# Altium project OneWireController.PrjPcb
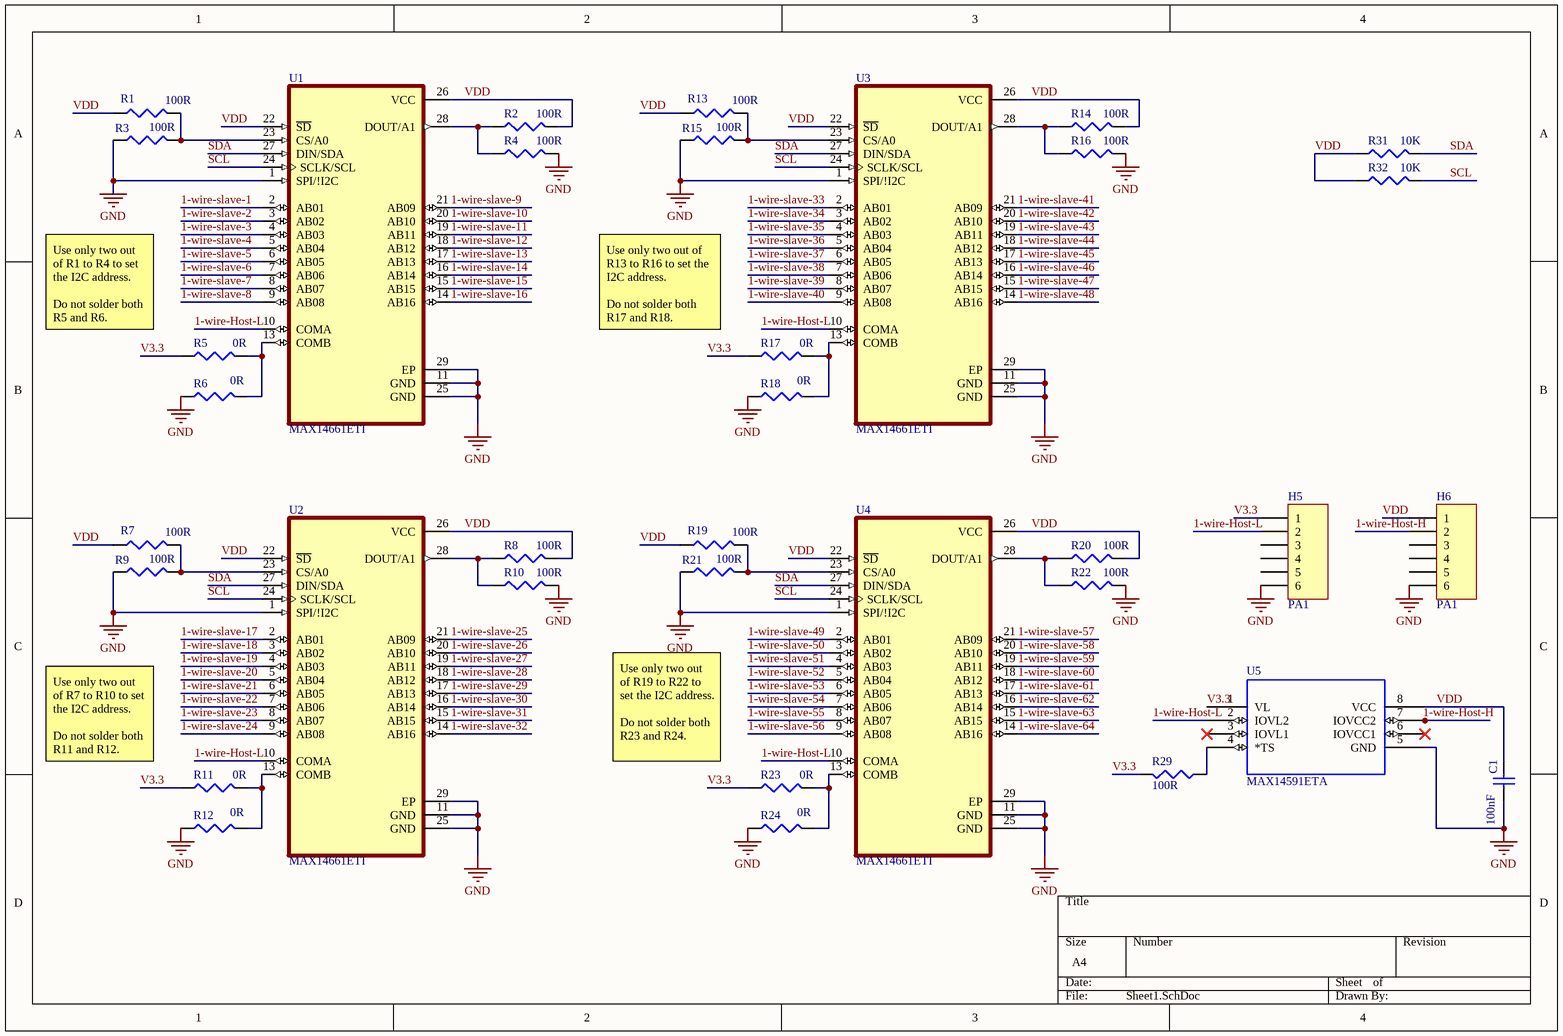
[diagram p0: Sheet1.SchDoc]
3 sheets, 126 parts. Net scope: global (net labels, ports and power ports of the same name join across sheets).
Board file: OneWireController.PcbDoc
Sheets:
  Sheet1.SchDoc
  Sheet2.SchDoc
  Sheet3.SchDoc

## Sheet Sheet1.SchDoc
size A4

### Parts
C1  value 100nF  [CAPC1608L]
H5  PA1  [HDR1X6]
H6  PA1  [HDR1X6]
R1  value 100R  [J1-0603]
R2  value 100R  [J1-0603]
R3  value 100R  [J1-0603]
R4  value 100R  [J1-0603]
R5  value 0R  [J1-0603]
R6  value 0R  [J1-0603]
R7  value 100R  [J1-0603]
R8  value 100R  [J1-0603]
R9  value 100R  [J1-0603]
R10  value 100R  [J1-0603]
R11  value 0R  [J1-0603]
R12  value 0R  [J1-0603]
R13  value 100R  [J1-0603]
R14  value 100R  [J1-0603]
R15  value 100R  [J1-0603]
R16  value 100R  [J1-0603]
R17  value 0R  [J1-0603]
R18  value 0R  [J1-0603]
R19  value 100R  [J1-0603]
R20  value 100R  [J1-0603]
R21  value 100R  [J1-0603]
R22  value 100R  [J1-0603]
R23  value 0R  [J1-0603]
R24  value 0R  [J1-0603]
R29  value 100R  [J1-0603]
R31  value 10K  [J1-0603]
R32  value 10K  [J1-0603]
U1  MAX14661ETI  [QFN40P400X400X80-29N]
U2  MAX14661ETI  [QFN40P400X400X80-29N]
U3  MAX14661ETI  [QFN40P400X400X80-29N]
U4  MAX14661ETI  [QFN40P400X400X80-29N]
U5  MAX14591ETA  [21-0487A]

### Nets
GND: C1.2 H5.6 H6.6 R3.1 R4.1 R6.1 R9.1 R10.1 R12.1 R15.1 R16.1 R18.1 R21.1 R22.1 R24.1 U1.1(SPI/!I2C) U1.11(GND) U1.25(GND) U1.29(EP) U2.1(SPI/!I2C) U2.11(GND) U2.25(GND) U2.29(EP) U3.1(SPI/!I2C) U3.11(GND) U3.25(GND) U3.29(EP) U4.1(SPI/!I2C) U4.11(GND) U4.25(GND) U4.29(EP) U5.5(GND)
1-wire-Host-H: H6.2 U5.7(IOVCC2)
1-wire-Host-L: H5.2 U1.10(COMA) U2.10(COMA) U3.10(COMA) U4.10(COMA) U5.2(IOVL2)
1-wire-slave-1: U1.2(AB01)
1-wire-slave-2: U1.3(AB02)
1-wire-slave-3: U1.4(AB03)
1-wire-slave-4: U1.5(AB04)
1-wire-slave-5: U1.6(AB05)
1-wire-slave-6: U1.7(AB06)
1-wire-slave-7: U1.8(AB07)
1-wire-slave-8: U1.9(AB08)
1-wire-slave-9: U1.21(AB09)
1-wire-slave-10: U1.20(AB10)
1-wire-slave-11: U1.19(AB11)
1-wire-slave-12: U1.18(AB12)
1-wire-slave-13: U1.17(AB13)
1-wire-slave-14: U1.16(AB14)
1-wire-slave-15: U1.15(AB15)
1-wire-slave-16: U1.14(AB16)
1-wire-slave-17: U2.2(AB01)
1-wire-slave-18: U2.3(AB02)
1-wire-slave-19: U2.4(AB03)
1-wire-slave-20: U2.5(AB04)
1-wire-slave-21: U2.6(AB05)
1-wire-slave-22: U2.7(AB06)
1-wire-slave-23: U2.8(AB07)
1-wire-slave-24: U2.9(AB08)
1-wire-slave-25: U2.21(AB09)
1-wire-slave-26: U2.20(AB10)
1-wire-slave-27: U2.19(AB11)
1-wire-slave-28: U2.18(AB12)
1-wire-slave-29: U2.17(AB13)
1-wire-slave-30: U2.16(AB14)
1-wire-slave-31: U2.15(AB15)
1-wire-slave-32: U2.14(AB16)
1-wire-slave-33: U3.2(AB01)
1-wire-slave-34: U3.3(AB02)
1-wire-slave-35: U3.4(AB03)
1-wire-slave-36: U3.5(AB04)
1-wire-slave-37: U3.6(AB05)
1-wire-slave-38: U3.7(AB06)
1-wire-slave-39: U3.8(AB07)
1-wire-slave-40: U3.9(AB08)
1-wire-slave-41: U3.21(AB09)
1-wire-slave-42: U3.20(AB10)
1-wire-slave-43: U3.19(AB11)
1-wire-slave-44: U3.18(AB12)
1-wire-slave-45: U3.17(AB13)
1-wire-slave-46: U3.16(AB14)
1-wire-slave-47: U3.15(AB15)
1-wire-slave-48: U3.14(AB16)
1-wire-slave-49: U4.2(AB01)
1-wire-slave-50: U4.3(AB02)
1-wire-slave-51: U4.4(AB03)
1-wire-slave-52: U4.5(AB04)
1-wire-slave-53: U4.6(AB05)
1-wire-slave-54: U4.7(AB06)
1-wire-slave-55: U4.8(AB07)
1-wire-slave-56: U4.9(AB08)
1-wire-slave-57: U4.21(AB09)
1-wire-slave-58: U4.20(AB10)
1-wire-slave-59: U4.19(AB11)
1-wire-slave-60: U4.18(AB12)
1-wire-slave-61: U4.17(AB13)
1-wire-slave-62: U4.16(AB14)
1-wire-slave-63: U4.15(AB15)
1-wire-slave-64: U4.14(AB16)
SCL: R32.1 U1.24(SCLK/SCL) U2.24(SCLK/SCL) U3.24(SCLK/SCL) U4.24(SCLK/SCL)
SDA: R31.1 U1.27(DIN/SDA) U2.27(DIN/SDA) U3.27(DIN/SDA) U4.27(DIN/SDA)
V3.3: H5.1 R5.1 R11.1 R17.1 R23.1 R29.1 U5.1(VL)
VDD: C1.1 H6.1 R1.1 R2.1 R7.1 R8.1 R13.1 R14.1 R19.1 R20.1 R31.2 R32.2 U1.22(~{SD}) U1.26(VCC) U2.22(~{SD}) U2.26(VCC) U3.22(~{SD}) U3.26(VCC) U4.22(~{SD}) U4.26(VCC) U5.8(VCC)
NetR1_2: R1.2 R3.2 U1.23(CS/A0)
NetR2_2: R2.2 R4.2 U1.28(DOUT/A1)
NetR5_2: R5.2 R6.2 U1.13(COMB)
NetR7_2: R7.2 R9.2 U2.23(CS/A0)
NetR8_2: R8.2 R10.2 U2.28(DOUT/A1)
NetR11_2: R11.2 R12.2 U2.13(COMB)
NetR13_2: R13.2 R15.2 U3.23(CS/A0)
NetR14_2: R14.2 R16.2 U3.28(DOUT/A1)
NetR17_2: R17.2 R18.2 U3.13(COMB)
NetR19_2: R19.2 R21.2 U4.23(CS/A0)
NetR20_2: R20.2 R22.2 U4.28(DOUT/A1)
NetR23_2: R23.2 R24.2 U4.13(COMB)
NetR29_2: R29.2 U5.4(*TS)

Not connected (* = marked no-connect by the designer): H5 3 4 5; H6 3 4 5; U5 3(IOVL1)* 6(IOVCC1)*

### Notes on the sheet
- (near R5) Use only two out of R1 to R4 to set the I2C address.
  Do not solder both R5 and R6.
- (near R17) Use only two out of R13 to R16 to set the I2C address.
  Do not solder both R17 and R18.
- (near R11) Use only two out of R7 to R10 to set the I2C address.
  Do not solder both R11 and R12.
- (near R23) Use only two out of R19 to R22 to set the I2C address.
  Do not solder both R23 and R24.

### Library data of the parts
C1 = Cap Semi: Capacitor (Semiconductor SIM Model); Published: 8-Jun-2000; LatestRevisionDate: 29-May-2009; LatestRevisionNote: IPC-7351 Footprint Added.; PackageReference: C1206; Publisher: Altium Limited; PackageDescription: Chip Capacitor
H5 H6 = Header 6: Header, 6-Pin; LatestRevisionDate: 17-Jul-2002; LatestRevisionNote: Re-released for DXP Platform.; Publisher: Altium Limited
R1-R24 R29 R31 R32 = Res3: Resistor; Published: 8-Jun-2000; LatestRevisionDate: 29-May-2009; LatestRevisionNote: IPC-7351 Footprint Added.; PackageReference: J1-0603; Publisher: Altium Limited; PackageDescription: Chip Resistor
U1-U4 = MAX14661ETI: None; MF: {'manufacturer': u'Maxim Integrated'}; Price: None; Availability: Unavailable; Value: *; MP: MAX14661ETI; Package: None
U5 = MAX14591ETA: MF: {'manufacturer': u'Maxim Integrated'}; MP: MAX14591ETA; Value: *; Package: None; Price: None; Availability: Unavailable

## Sheet Sheet2.SchDoc
size A4
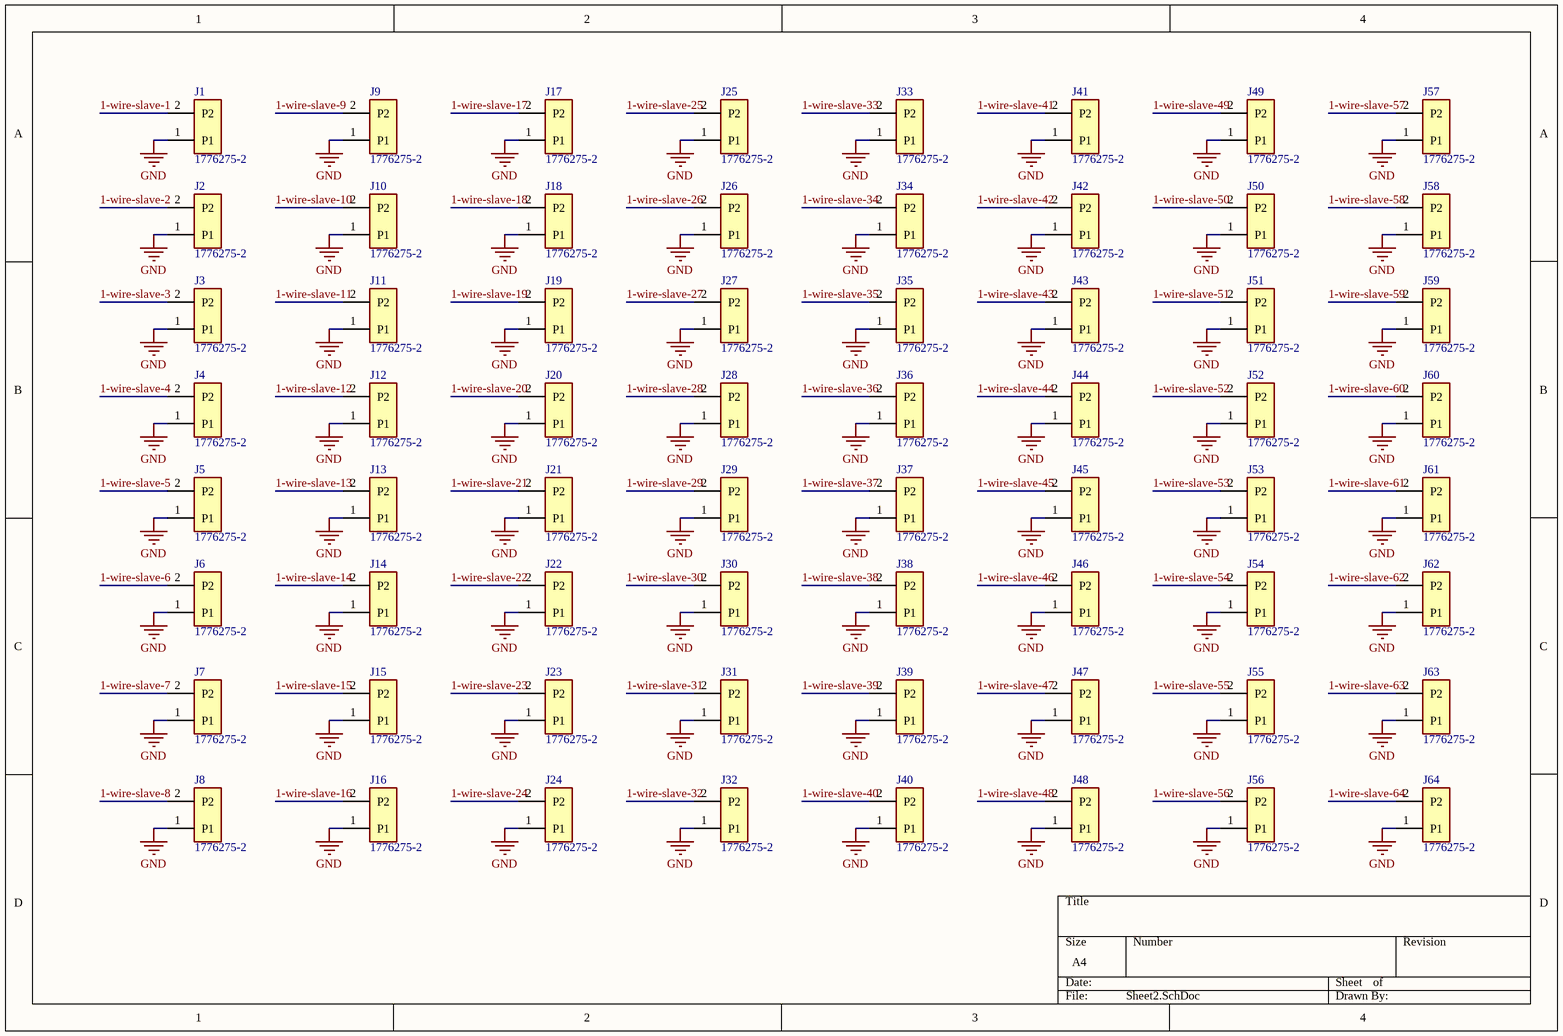
[diagram p1: Sheet2.SchDoc]

### Parts
J1  1776275-2  [TE_1776275-2]
J2  1776275-2  [TE_1776275-2]
J3  1776275-2  [TE_1776275-2]
J4  1776275-2  [TE_1776275-2]
J5  1776275-2  [TE_1776275-2]
J6  1776275-2  [TE_1776275-2]
J7  1776275-2  [TE_1776275-2]
J8  1776275-2  [TE_1776275-2]
J9  1776275-2  [TE_1776275-2]
J10  1776275-2  [TE_1776275-2]
J11  1776275-2  [TE_1776275-2]
J12  1776275-2  [TE_1776275-2]
J13  1776275-2  [TE_1776275-2]
J14  1776275-2  [TE_1776275-2]
J15  1776275-2  [TE_1776275-2]
J16  1776275-2  [TE_1776275-2]
J17  1776275-2  [TE_1776275-2]
J18  1776275-2  [TE_1776275-2]
J19  1776275-2  [TE_1776275-2]
J20  1776275-2  [TE_1776275-2]
J21  1776275-2  [TE_1776275-2]
J22  1776275-2  [TE_1776275-2]
J23  1776275-2  [TE_1776275-2]
J24  1776275-2  [TE_1776275-2]
J25  1776275-2  [TE_1776275-2]
J26  1776275-2  [TE_1776275-2]
J27  1776275-2  [TE_1776275-2]
J28  1776275-2  [TE_1776275-2]
J29  1776275-2  [TE_1776275-2]
J30  1776275-2  [TE_1776275-2]
J31  1776275-2  [TE_1776275-2]
J32  1776275-2  [TE_1776275-2]
J33  1776275-2  [TE_1776275-2]
J34  1776275-2  [TE_1776275-2]
J35  1776275-2  [TE_1776275-2]
J36  1776275-2  [TE_1776275-2]
J37  1776275-2  [TE_1776275-2]
J38  1776275-2  [TE_1776275-2]
J39  1776275-2  [TE_1776275-2]
J40  1776275-2  [TE_1776275-2]
J41  1776275-2  [TE_1776275-2]
J42  1776275-2  [TE_1776275-2]
J43  1776275-2  [TE_1776275-2]
J44  1776275-2  [TE_1776275-2]
J45  1776275-2  [TE_1776275-2]
J46  1776275-2  [TE_1776275-2]
J47  1776275-2  [TE_1776275-2]
J48  1776275-2  [TE_1776275-2]
J49  1776275-2  [TE_1776275-2]
J50  1776275-2  [TE_1776275-2]
J51  1776275-2  [TE_1776275-2]
J52  1776275-2  [TE_1776275-2]
J53  1776275-2  [TE_1776275-2]
J54  1776275-2  [TE_1776275-2]
J55  1776275-2  [TE_1776275-2]
J56  1776275-2  [TE_1776275-2]
J57  1776275-2  [TE_1776275-2]
J58  1776275-2  [TE_1776275-2]
J59  1776275-2  [TE_1776275-2]
J60  1776275-2  [TE_1776275-2]
J61  1776275-2  [TE_1776275-2]
J62  1776275-2  [TE_1776275-2]
J63  1776275-2  [TE_1776275-2]
J64  1776275-2  [TE_1776275-2]

### Nets
GND: J1.1(P1) J2.1(P1) J3.1(P1) J4.1(P1) J5.1(P1) J6.1(P1) J7.1(P1) J8.1(P1) J9.1(P1) J10.1(P1) J11.1(P1) J12.1(P1) J13.1(P1) J14.1(P1) J15.1(P1) J16.1(P1) J17.1(P1) J18.1(P1) J19.1(P1) J20.1(P1) J21.1(P1) J22.1(P1) J23.1(P1) J24.1(P1) J25.1(P1) J26.1(P1) J27.1(P1) J28.1(P1) J29.1(P1) J30.1(P1) J31.1(P1) J32.1(P1) J33.1(P1) J34.1(P1) J35.1(P1) J36.1(P1) J37.1(P1) J38.1(P1) J39.1(P1) J40.1(P1) J41.1(P1) J42.1(P1) J43.1(P1) J44.1(P1) J45.1(P1) J46.1(P1) J47.1(P1) J48.1(P1) J49.1(P1) J50.1(P1) J51.1(P1) J52.1(P1) J53.1(P1) J54.1(P1) J55.1(P1) J56.1(P1) J57.1(P1) J58.1(P1) J59.1(P1) J60.1(P1) J61.1(P1) J62.1(P1) J63.1(P1) J64.1(P1)
1-wire-slave-1: J1.2(P2)
1-wire-slave-2: J2.2(P2)
1-wire-slave-3: J3.2(P2)
1-wire-slave-4: J4.2(P2)
1-wire-slave-5: J5.2(P2)
1-wire-slave-6: J6.2(P2)
1-wire-slave-7: J7.2(P2)
1-wire-slave-8: J8.2(P2)
1-wire-slave-9: J9.2(P2)
1-wire-slave-10: J10.2(P2)
1-wire-slave-11: J11.2(P2)
1-wire-slave-12: J12.2(P2)
1-wire-slave-13: J13.2(P2)
1-wire-slave-14: J14.2(P2)
1-wire-slave-15: J15.2(P2)
1-wire-slave-16: J16.2(P2)
1-wire-slave-17: J17.2(P2)
1-wire-slave-18: J18.2(P2)
1-wire-slave-19: J19.2(P2)
1-wire-slave-20: J20.2(P2)
1-wire-slave-21: J21.2(P2)
1-wire-slave-22: J22.2(P2)
1-wire-slave-23: J23.2(P2)
1-wire-slave-24: J24.2(P2)
1-wire-slave-25: J25.2(P2)
1-wire-slave-26: J26.2(P2)
1-wire-slave-27: J27.2(P2)
1-wire-slave-28: J28.2(P2)
1-wire-slave-29: J29.2(P2)
1-wire-slave-30: J30.2(P2)
1-wire-slave-31: J31.2(P2)
1-wire-slave-32: J32.2(P2)
1-wire-slave-33: J33.2(P2)
1-wire-slave-34: J34.2(P2)
1-wire-slave-35: J35.2(P2)
1-wire-slave-36: J36.2(P2)
1-wire-slave-37: J37.2(P2)
1-wire-slave-38: J38.2(P2)
1-wire-slave-39: J39.2(P2)
1-wire-slave-40: J40.2(P2)
1-wire-slave-41: J41.2(P2)
1-wire-slave-42: J42.2(P2)
1-wire-slave-43: J43.2(P2)
1-wire-slave-44: J44.2(P2)
1-wire-slave-45: J45.2(P2)
1-wire-slave-46: J46.2(P2)
1-wire-slave-47: J47.2(P2)
1-wire-slave-48: J48.2(P2)
1-wire-slave-49: J49.2(P2)
1-wire-slave-50: J50.2(P2)
1-wire-slave-51: J51.2(P2)
1-wire-slave-52: J52.2(P2)
1-wire-slave-53: J53.2(P2)
1-wire-slave-54: J54.2(P2)
1-wire-slave-55: J55.2(P2)
1-wire-slave-56: J56.2(P2)
1-wire-slave-57: J57.2(P2)
1-wire-slave-58: J58.2(P2)
1-wire-slave-59: J59.2(P2)
1-wire-slave-60: J60.2(P2)
1-wire-slave-61: J61.2(P2)
1-wire-slave-62: J62.2(P2)
1-wire-slave-63: J63.2(P2)
1-wire-slave-64: J64.2(P2)

### Library data of the parts
J1-J64 = 1776275-2: TERM BLOCK 2POS SIDE ENT 3.5MM; MF: {'manufacturer': u'TE Connectivity'}; Value: *; MP: 1776275-2; Availability: Unavailable; Price: None; Package: None

## Sheet Sheet3.SchDoc
size A4
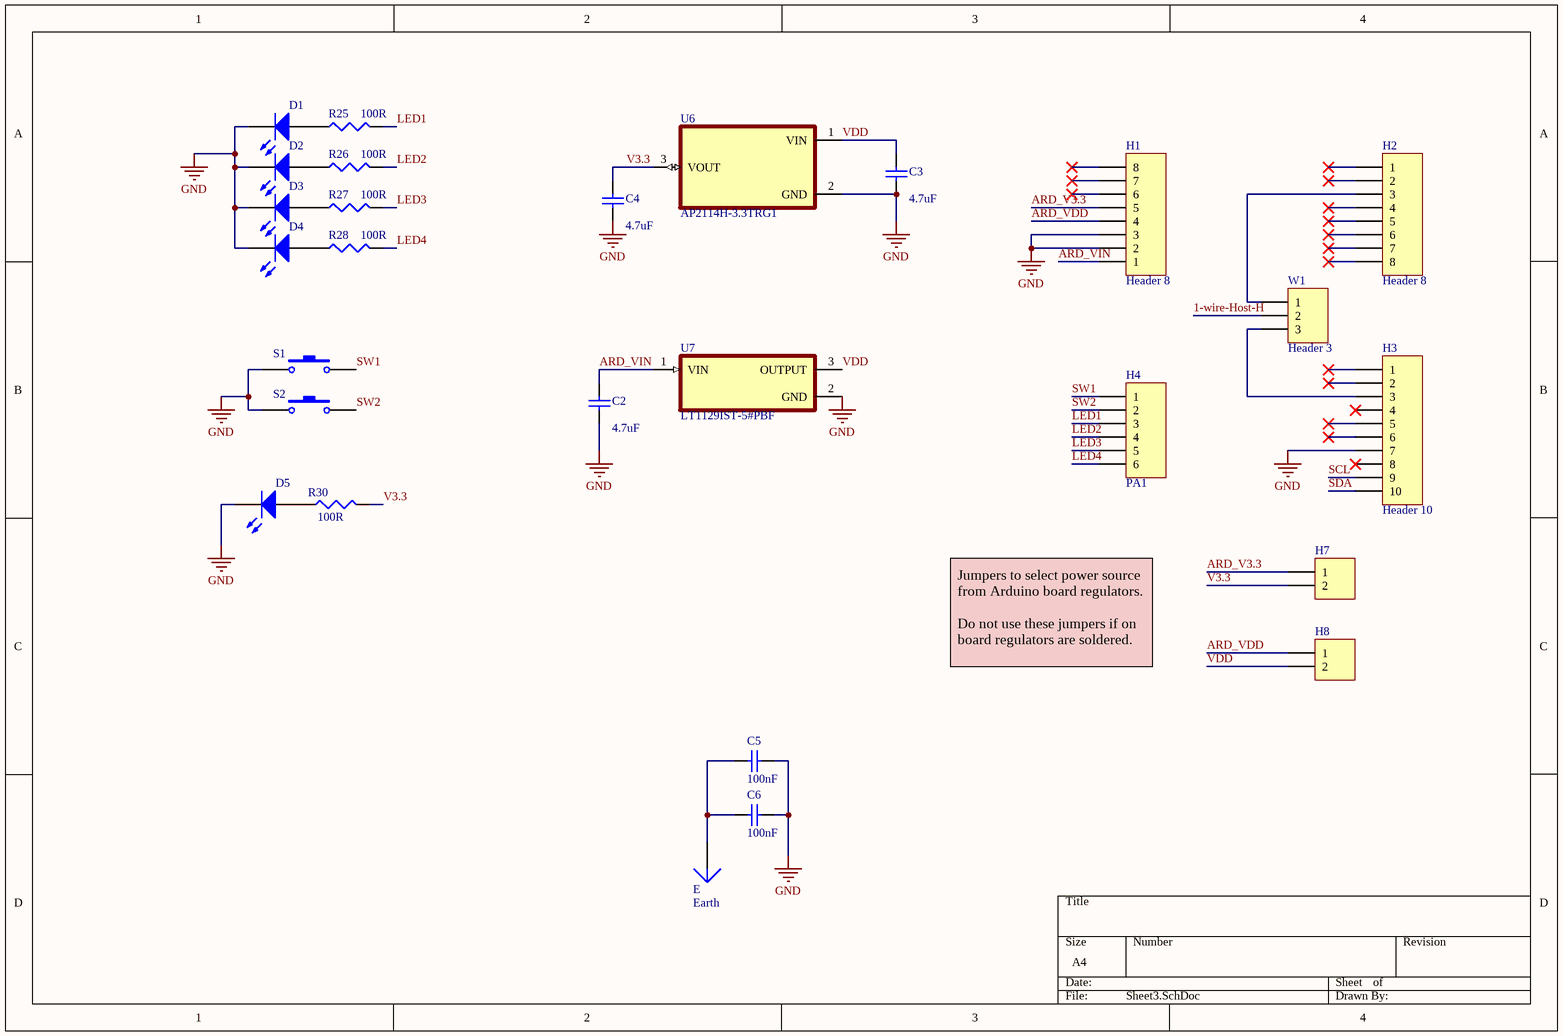
[diagram p2: Sheet3.SchDoc]

### Parts
C2  value 4.7uF  [C0805]
C3  value 4.7uF  [C0805]
C4  value 4.7uF  [C0805]
C5  value 100nF  [CAPC1608L]
C6  value 100nF  [CAPC1608L]
D1  (no value)  [6-0805_N]
D2  (no value)  [6-0805_N]
D3  (no value)  [6-0805_N]
D4  (no value)  [6-0805_N]
D5  (no value)  [6-0805_N]
E  Earth  [PIN1]
H1  Header 8  [HDR1X8]
H2  Header 8  [HDR1X8]
H3  Header 10  [HDR1X10]
H4  PA1  [HDR1X6]
H7  (no value)  [HDR1X2]
H8  (no value)  [HDR1X2]
R25  value 100R  [J1-0603]
R26  value 100R  [J1-0603]
R27  value 100R  [J1-0603]
R28  value 100R  [J1-0603]
R30  value 100R  [J1-0603]
S1  (no value)  [PTS525SM08SMTR2LFS]
S2  (no value)  [PTS525SM08SMTR2LFS]
U6  AP2114H-3.3TRG1  [SOT230P700X180-4N]
U7  LT1129IST-5#PBF  [SOT230P700X180-4N]
W1  Header 3  [HDR1X3]

### Nets
GND: C2.1 C3.1 C4.1 C5.2 C6.2 D1.2(K) D2.2(K) D3.2(K) D4.2(K) D5.2(K) H1.2 H1.3 H3.7 S1.1 S2.1 U6.2(GND) U7.2(GND)
1-wire-Host-H: W1.2
ARD_V3.3: H1.5 H7.1
ARD_VDD: H1.4 H8.1
ARD_VIN: C2.2 H1.1 U7.1(VIN)
LED1: H4.3 R25.1
LED2: H4.4 R26.1
LED3: H4.5 R27.1
LED4: H4.6 R28.1
SCL: H3.9
SDA: H3.10
SW1: H4.1 S1.2
SW2: H4.2 S2.2
V3.3: C4.2 H7.2 R30.1 U6.3(VOUT)
VDD: C3.2 H8.2 U6.1(VIN) U7.3(OUTPUT)
NetC5_1: C5.1 C6.1 E.1
NetD1_1: D1.1(A) R25.2
NetD2_1: D2.1(A) R26.2
NetD3_1: D3.1(A) R27.2
NetD4_1: D4.1(A) R28.2
NetD5_1: D5.1(A) R30.2
NetH2_3: H2.3 W1.1
NetH3_3: H3.3 W1.3

Not connected (* = marked no-connect by the designer): H1 6* 7* 8*; H2 1* 2* 4* 5* 6* 7* 8*; H3 1* 2* 4* 5* 6* 8*

### Notes on the sheet
- Jumpers to select power source from Arduino board regulators.
  Do not use these jumpers if on board regulators are soldered.

### Library data of the parts
C2-C6 = Cap Semi: Capacitor (Semiconductor SIM Model); Published: 8-Jun-2000; LatestRevisionDate: 29-May-2009; LatestRevisionNote: IPC-7351 Footprint Added.; PackageReference: C1206; Publisher: Altium Limited; PackageDescription: Chip Capacitor
D1-D5 = LED3: Typical BLUE SiC LED; Published: 8-Jun-2000; LatestRevisionDate: 17-Dec-2003; LatestRevisionNote: PCB Footprint replaced.; DatasheetVersion: 16-Apr-2002; PackageVersion: 16-Apr-2002; PackageReference: 3.5X2.8X1.9; Publisher: Altium Limited; PackageDescription: SM LED; 2 C-Bend Leads; Body 3.5 x 2.8 x 1.9 mm, inc leads (LxWxH typ)
E = Plug: LatestRevisionDate: 17-Jul-2002; LatestRevisionNote: Re-released for DXP Platform.; Publisher: Altium Limited
H1 H2 = Header 8: Header, 8-Pin; LatestRevisionDate: 17-Jul-2002; LatestRevisionNote: Re-released for DXP Platform.; Publisher: Altium Limited
H3 = Header 10: Header, 10-Pin; LatestRevisionDate: 17-Jul-2002; LatestRevisionNote: Re-released for DXP Platform.; Publisher: Altium Limited
H4 = Header 6: Header, 6-Pin; LatestRevisionDate: 17-Jul-2002; LatestRevisionNote: Re-released for DXP Platform.; Publisher: Altium Limited
H7 H8 = Header 2: Header, 2-Pin; LatestRevisionDate: 17-Jul-2002; LatestRevisionNote: Re-released for DXP Platform.; Publisher: Altium Limited
R25-R28 R30 = Res3: Resistor; Published: 8-Jun-2000; LatestRevisionDate: 29-May-2009; LatestRevisionNote: IPC-7351 Footprint Added.; PackageReference: J1-0603; Publisher: Altium Limited; PackageDescription: Chip Resistor
S1 S2 = SW-PB: Switch; Published: 24-Mar-1999; LatestRevisionDate: 17-Jul-2002; LatestRevisionNote: Re-released for DXP Platform.; PackageReference: SPST-2; Publisher: Altium Limited; PackageDescription: Switch; 2 Leads
U6 = AP2114H-3.3TRG1: MF: {'manufacturer': u'Diodes Inc.'}; Price: None; Availability: Unavailable; Value: *; MP: AP2114H-3.3TRG1; Package: None
U7 = LT1129IST-5#PBF: MF: {'manufacturer': u'Analog Devices'}; Availability: Unavailable; Price: None; Value: *; MP: LT1129IST-5#PBF; Package: None
W1 = Header 3: Header, 3-Pin; LatestRevisionDate: 17-Jul-2002; LatestRevisionNote: Re-released for DXP Platform.; Publisher: Altium Limited

## Nets that join several sheets
GND: Sheet1 (32 pins), Sheet2 (64 pins), Sheet3 (17 pins)
1-wire-Host-H: Sheet1 (H6.2 U5.7), Sheet3 (W1.2)
1-wire-slave-1: Sheet1 (U1.2), Sheet2 (J1.2)
1-wire-slave-2: Sheet1 (U1.3), Sheet2 (J2.2)
1-wire-slave-3: Sheet1 (U1.4), Sheet2 (J3.2)
1-wire-slave-4: Sheet1 (U1.5), Sheet2 (J4.2)
1-wire-slave-5: Sheet1 (U1.6), Sheet2 (J5.2)
1-wire-slave-6: Sheet1 (U1.7), Sheet2 (J6.2)
1-wire-slave-7: Sheet1 (U1.8), Sheet2 (J7.2)
1-wire-slave-8: Sheet1 (U1.9), Sheet2 (J8.2)
1-wire-slave-9: Sheet1 (U1.21), Sheet2 (J9.2)
1-wire-slave-10: Sheet1 (U1.20), Sheet2 (J10.2)
1-wire-slave-11: Sheet1 (U1.19), Sheet2 (J11.2)
1-wire-slave-12: Sheet1 (U1.18), Sheet2 (J12.2)
1-wire-slave-13: Sheet1 (U1.17), Sheet2 (J13.2)
1-wire-slave-14: Sheet1 (U1.16), Sheet2 (J14.2)
1-wire-slave-15: Sheet1 (U1.15), Sheet2 (J15.2)
1-wire-slave-16: Sheet1 (U1.14), Sheet2 (J16.2)
1-wire-slave-17: Sheet1 (U2.2), Sheet2 (J17.2)
1-wire-slave-18: Sheet1 (U2.3), Sheet2 (J18.2)
1-wire-slave-19: Sheet1 (U2.4), Sheet2 (J19.2)
1-wire-slave-20: Sheet1 (U2.5), Sheet2 (J20.2)
1-wire-slave-21: Sheet1 (U2.6), Sheet2 (J21.2)
1-wire-slave-22: Sheet1 (U2.7), Sheet2 (J22.2)
1-wire-slave-23: Sheet1 (U2.8), Sheet2 (J23.2)
1-wire-slave-24: Sheet1 (U2.9), Sheet2 (J24.2)
1-wire-slave-25: Sheet1 (U2.21), Sheet2 (J25.2)
1-wire-slave-26: Sheet1 (U2.20), Sheet2 (J26.2)
1-wire-slave-27: Sheet1 (U2.19), Sheet2 (J27.2)
1-wire-slave-28: Sheet1 (U2.18), Sheet2 (J28.2)
1-wire-slave-29: Sheet1 (U2.17), Sheet2 (J29.2)
1-wire-slave-30: Sheet1 (U2.16), Sheet2 (J30.2)
1-wire-slave-31: Sheet1 (U2.15), Sheet2 (J31.2)
1-wire-slave-32: Sheet1 (U2.14), Sheet2 (J32.2)
1-wire-slave-33: Sheet1 (U3.2), Sheet2 (J33.2)
1-wire-slave-34: Sheet1 (U3.3), Sheet2 (J34.2)
1-wire-slave-35: Sheet1 (U3.4), Sheet2 (J35.2)
1-wire-slave-36: Sheet1 (U3.5), Sheet2 (J36.2)
1-wire-slave-37: Sheet1 (U3.6), Sheet2 (J37.2)
1-wire-slave-38: Sheet1 (U3.7), Sheet2 (J38.2)
1-wire-slave-39: Sheet1 (U3.8), Sheet2 (J39.2)
1-wire-slave-40: Sheet1 (U3.9), Sheet2 (J40.2)
1-wire-slave-41: Sheet1 (U3.21), Sheet2 (J41.2)
1-wire-slave-42: Sheet1 (U3.20), Sheet2 (J42.2)
1-wire-slave-43: Sheet1 (U3.19), Sheet2 (J43.2)
1-wire-slave-44: Sheet1 (U3.18), Sheet2 (J44.2)
1-wire-slave-45: Sheet1 (U3.17), Sheet2 (J45.2)
1-wire-slave-46: Sheet1 (U3.16), Sheet2 (J46.2)
1-wire-slave-47: Sheet1 (U3.15), Sheet2 (J47.2)
1-wire-slave-48: Sheet1 (U3.14), Sheet2 (J48.2)
1-wire-slave-49: Sheet1 (U4.2), Sheet2 (J49.2)
1-wire-slave-50: Sheet1 (U4.3), Sheet2 (J50.2)
1-wire-slave-51: Sheet1 (U4.4), Sheet2 (J51.2)
1-wire-slave-52: Sheet1 (U4.5), Sheet2 (J52.2)
1-wire-slave-53: Sheet1 (U4.6), Sheet2 (J53.2)
1-wire-slave-54: Sheet1 (U4.7), Sheet2 (J54.2)
1-wire-slave-55: Sheet1 (U4.8), Sheet2 (J55.2)
1-wire-slave-56: Sheet1 (U4.9), Sheet2 (J56.2)
1-wire-slave-57: Sheet1 (U4.21), Sheet2 (J57.2)
1-wire-slave-58: Sheet1 (U4.20), Sheet2 (J58.2)
1-wire-slave-59: Sheet1 (U4.19), Sheet2 (J59.2)
1-wire-slave-60: Sheet1 (U4.18), Sheet2 (J60.2)
1-wire-slave-61: Sheet1 (U4.17), Sheet2 (J61.2)
1-wire-slave-62: Sheet1 (U4.16), Sheet2 (J62.2)
1-wire-slave-63: Sheet1 (U4.15), Sheet2 (J63.2)
1-wire-slave-64: Sheet1 (U4.14), Sheet2 (J64.2)
SCL: Sheet1 (5 pins), Sheet3 (H3.9)
SDA: Sheet1 (5 pins), Sheet3 (H3.10)
V3.3: Sheet1 (7 pins), Sheet3 (C4.2 H7.2 R30.1 U6.3)
VDD: Sheet1 (21 pins), Sheet3 (C3.2 H8.2 U6.1 U7.3)